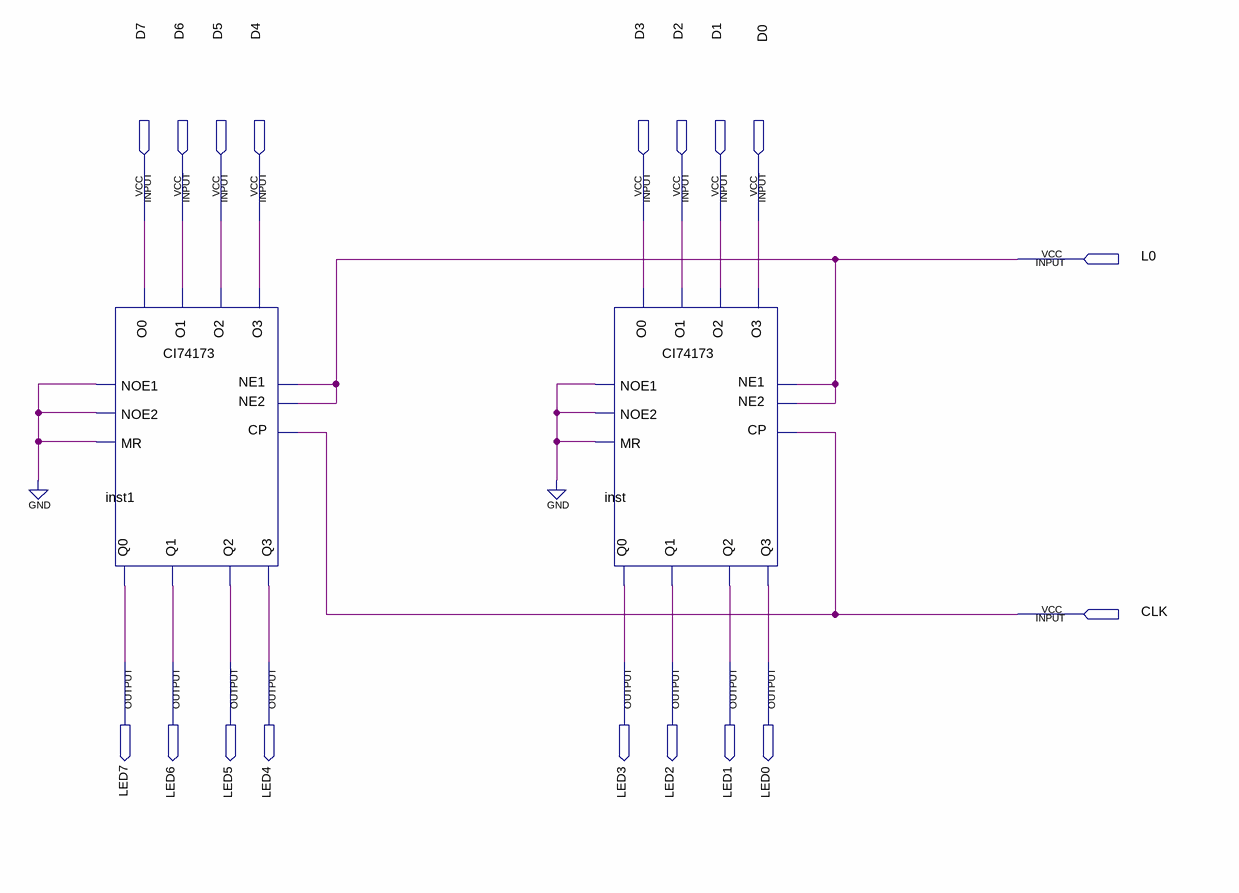
[diagram p0: schematic sheet]
// Quartus schematic RegistradorSaida.bdf as structural Verilog: 2 symbols, 18 pins
module RegistradorSaida (
  input  D7,
  input  D6,
  input  D5,
  input  D4,
  input  D3,
  input  D2,
  input  D1,
  input  D0,
  input  L0,
  input  CLK,
  output LED7,
  output LED6,
  output LED5,
  output LED4,
  output LED3,
  output LED2,
  output LED1,
  output LED0
);

  CI74173 inst1 (
    .O0(D7), .O1(D6), .O2(D5), .O3(D4), .NE1(L0), .NE2(L0), .CP(CLK), .MR(1'b0), .NOE1(1'b0), .NOE2(1'b0),
    .Q1(LED6), .Q2(LED5), .Q3(LED4), .Q0(LED7));
  CI74173 inst (
    .O0(D3), .O1(D2), .O2(D1), .O3(D0), .NE1(L0), .NE2(L0), .CP(CLK), .MR(1'b0), .NOE1(1'b0), .NOE2(1'b0),
    .Q1(LED2), .Q2(LED1), .Q3(LED0), .Q0(LED3));
endmodule
